# EAGLE design opemGBZ (EAGLE 9.1.0)
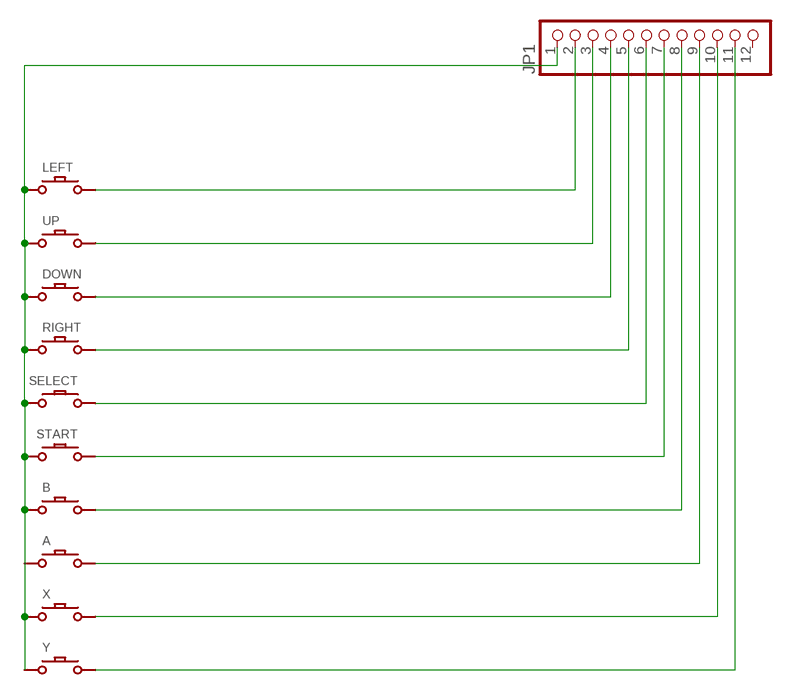
[diagram p0: schematic, sheet 1]

## Parts
A  DMG-BTN  DMG-BTNREGULAR  [DMG-BTN]
B  DMG-BTN  DMG-BTNREGULAR  [DMG-BTN]
DOWN  DMG-BTN  DMG-BTNREGULAR  [DMG-BTN]
JP1  PINHD-1X12  [1X12]
LEFT  DMG-BTN  DMG-BTNREGULAR  [DMG-BTN]
RIGHT  DMG-BTN  DMG-BTNREGULAR  [DMG-BTN]
SELECT  DMG-BTN  DMG-BTNSELECT  [DMG-SEL]
START  DMG-BTN  DMG-BTNSELECT  [DMG-SEL]
UP  DMG-BTN  DMG-BTNREGULAR  [DMG-BTN]
X  DMG-BTN  DMG-BTNREGULAR  [DMG-BTN]
Y  DMG-BTN  DMG-BTNREGULAR  [DMG-BTN]

## Nets
GND: A.P$1 B.P$1 DOWN.P$1 JP1.1 LEFT.P$1 RIGHT.P$1 SELECT.P$2 START.P$2 UP.P$1 X.P$1 Y.P$1
N$1: JP1.2 LEFT.P$2
N$2: JP1.3 UP.P$2
N$3: DOWN.P$2 JP1.4
N$4: JP1.5 RIGHT.P$2
N$5: JP1.6 SELECT.P$1
N$6: JP1.7 START.P$1
N$7: B.P$2 JP1.8
N$8: A.P$2 JP1.9
N$9: JP1.10 X.P$2
N$10: JP1.11 Y.P$2
Unconnected: JP1.12

## Library data of the parts
A B DOWN LEFT RIGHT SELECT START UP X Y = Game Boy:DMG-BTN
JP1 = pinhead:PINHD-1X12: PIN HEADER

## Board
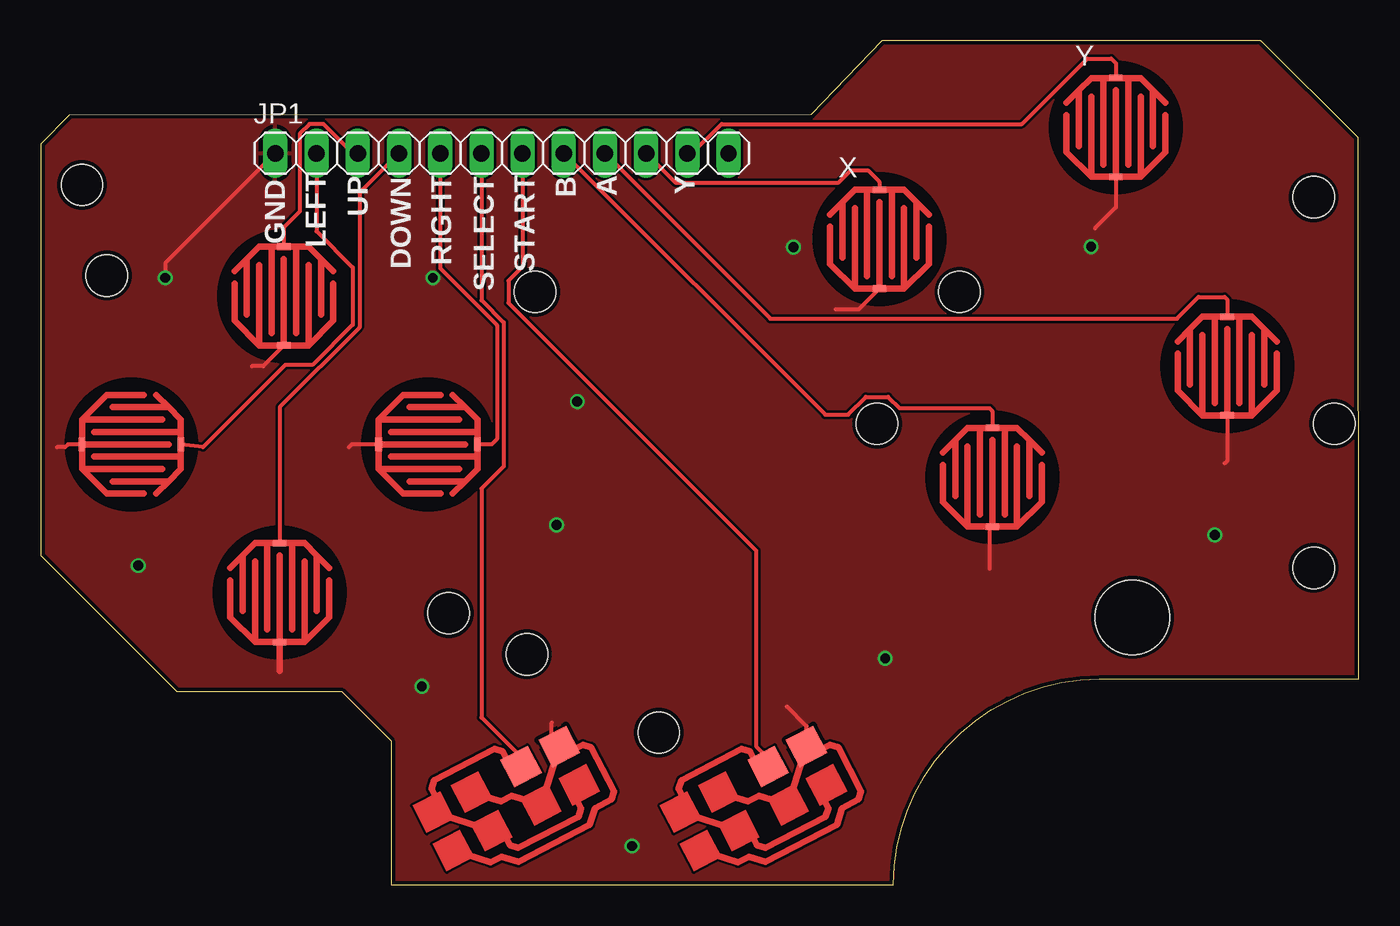
[diagram p1: board, top side]
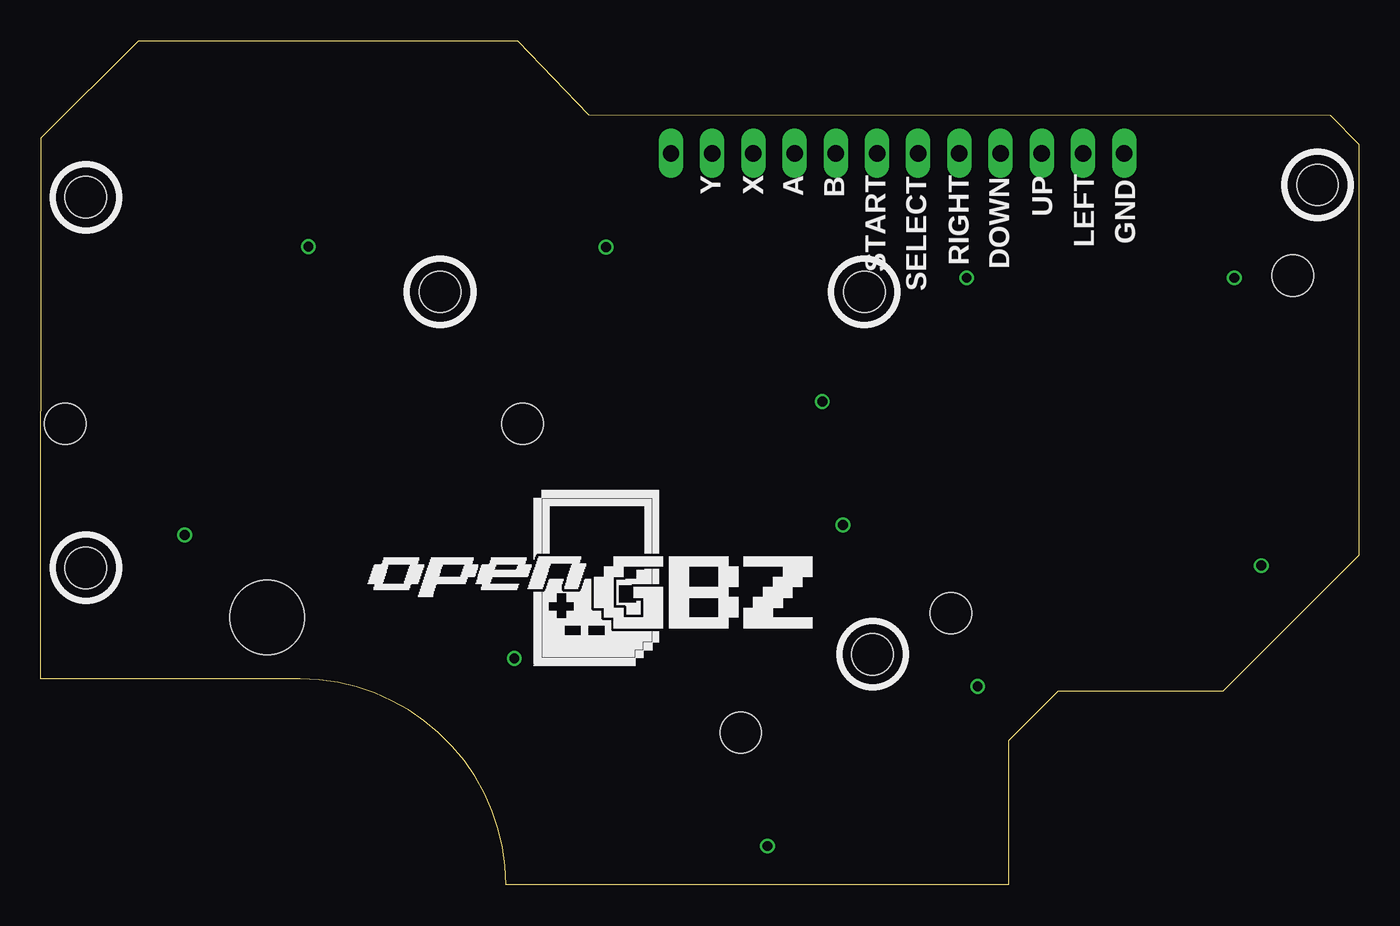
[diagram p2: board, bottom side, seen from below]

Size 81.3 x 52.08 mm. Coordinates in mm from the lower left corner, seen from the top.
Outline: 75.24,52.08 51.89,52.07 47.52,47.5 1.78,47.48 0,45.7 0.02,20.32 8.4,11.94 18.56,11.94 21.61,8.89 21.61,0 52.6,0 arc-90 65.3,12.7 81.3,12.7 81.26,45.73 81.26,45.75 81.26,46.01 81.26,46.01 81.26,46.06 81.25,46.08 81.25,46.08 75.24,52.08
Copper layers (1*16): Top 0.035mm / dielectric 1.5mm / Bottom 0.035mm
Design rules "ITEADstudio_DRC": minimum track width 6mil, minimum drill 12mil, track to track 6mil, track to pad 6mil, pad to pad 6mil, via to via 6mil, smd to smd 0mil, copper to edge 10mil, drill to drill 10mil, minimum pad ring 10mil, minimum via ring 6mil, stop-mask expansion 2mil, vias tented up to drill 100mil, thermal gap 10mil
Holes 4.57 mm at 67.33,16.51
Holes 2.54 mm at 2.56,43.18 78.5,42.42 78.5,19.56 30.5,36.58 56.66,36.58 29.99,14.22 51.58,28.45 25.16,16.76 38.12,9.4 79.77,28.45 4.08,37.59

### Footprints (pad centres in the part's own frame; a part is rotated, then mirrored left to right if it is on the bottom)
DMG-BTN = smd 0.813 x 0.406: P$1 0,-3.048; P$2 0,3.048
1X12 = drill 1.016 long: 1 -13.97,0; 2 -11.43,0; 3 -8.89,0; 4 -6.35,0; 5 -3.81,0; 6 -1.27,0; 7 1.27,0; 8 3.81,0; 9 6.35,0; 10 8.89,0; 11 11.43,0; 12 13.97,0
DMG-SEL = smd 1.905 x 1.905: P$1 1.714,1.333; P$2 4.381,1.333

### Placement (x,y rotation side)
A  73.17,32 0 top
B  58.69,25.15 0 top
DOWN  14.75,18.03 0 top
JP1  28.45,45.13 0 top
LEFT  5.61,27.18 270 top
RIGHT  23.89,27.18 270 top
SELECT  28.72,5.33 27.5 top
START  43.96,5.33 27.5 top
UP  15,36.32 0 top
X  51.73,39.83 0 top
Y  66.31,46.72 0 top

### Tracks (layer width: path | path; a pad name or v marks a point on that pad's centre or on a via)
GND  (via drill 0.6)
  Top 0.254: JP1.1 7.69,38.34 v7.69,37.44 | LEFT.P$1 1.7,27.18 1.52,27 1.02,27 | UP.P$1 13.73,32 13.02,32 | RIGHT.P$1 19.2,27.18 19.02,27 | SELECT.P$2 31.52,9.01 31.52,10 | START.P$2 47.23,9.79 46.02,11 | B.P$1 58.52,21.92 58.52,19.5 | A.P$1 73.17,26.15 73.02,26 | X.P$1 50.45,35.5 49.02,35.5 | Y.P$1 66.31,41.79 65.02,40.5
  Top 0.406: DOWN.P$1 14.75,13.2
  other vias: 6.02,19.7 23.52,12.25 31.82,22.2 36.47,2.4 52.09,13.97 72.41,21.59 64.79,39.37 24.2,37.44 33.09,29.82 46.42,39.34
  pour Top (rank 6): 0.04,45.75 1.78,47.48 1.8,47.48 47.35,47.48 51.91,52.04 75.32,52.04 75.5,51.86 81.27,46.09 81.27,45.56 81.27,12.75 81.22,12.69 65.05,12.69 65.05,12.69 arc90 52.55,0.2 52.55,0.03 21.6,0.03 21.6,0.03 21.6,8.84 18.5,11.94 8.35,11.94 0.04,20.25
N$1
  Top 0.254: JP1.2 17.02,40.32 19.26,38.08 19.26,34.56 16.77,32.07 15.09,32.07 10.02,27 LEFT.P$2
N$2
  Top 0.254: JP1.3 19.26,45.13 17.45,46.94 16.59,46.94 15.98,46.33 15.98,41.54 15.02,40.58 arc90 15,40.56 UP.P$2
N$3
  Top 0.254: JP1.4 19.67,42.7 19.67,34.39 14.75,29.48 14.75,22.5 14.75,22.29 DOWN.P$2
N$4
  Top 0.254: JP1.5 24.64,38.03 28.15,34.52 28.15,27.5 27.83,27.18 RIGHT.P$2
N$5
  Top 0.254: JP1.6 27.18,36.07 28.56,34.69 28.56,25.82 27.18,24.45 27.18,10.34 29.63,7.89 SELECT.P$1
N$6
  Top 0.254: JP1.7 29.72,38.13 28.85,37.26 28.85,35.89 44.12,20.62 44.12,8.55 44.87,7.8 START.P$1
N$7
  Top 0.254: JP1.8 48.39,29 49.8,29 50.9,30.1 52.26,30.1 52.96,29.4 58.52,29.4 58.69,29.23 B.P$2
N$8
  Top 0.254: JP1.9 45.01,34.92 70.07,34.92 71.41,36.26 73.02,36.26 73.17,36.11 A.P$2
N$9
  Top 0.254: JP1.10 39.14,43.33 49.21,43.33 49.97,44.08 51.02,44.08 51.73,43.37 X.P$2
N$10
  Top 0.254: JP1.11 40.19,45.13 41.99,46.94 60.51,46.94 64.55,50.97 66.02,50.97 66.31,50.68 Y.P$2

### Text on the board
tNames: GND | LEFT | UP | DOWN | RIGHT | SELECT | START | B | A | Y
bNames: GND | LEFT | UP | DOWN | RIGHT | SELECT | START | B | A | X | X | Y